# Altium schematic sheet Sheet_1_2024-11-17 (1).schdoc
size 361 x 224 mm
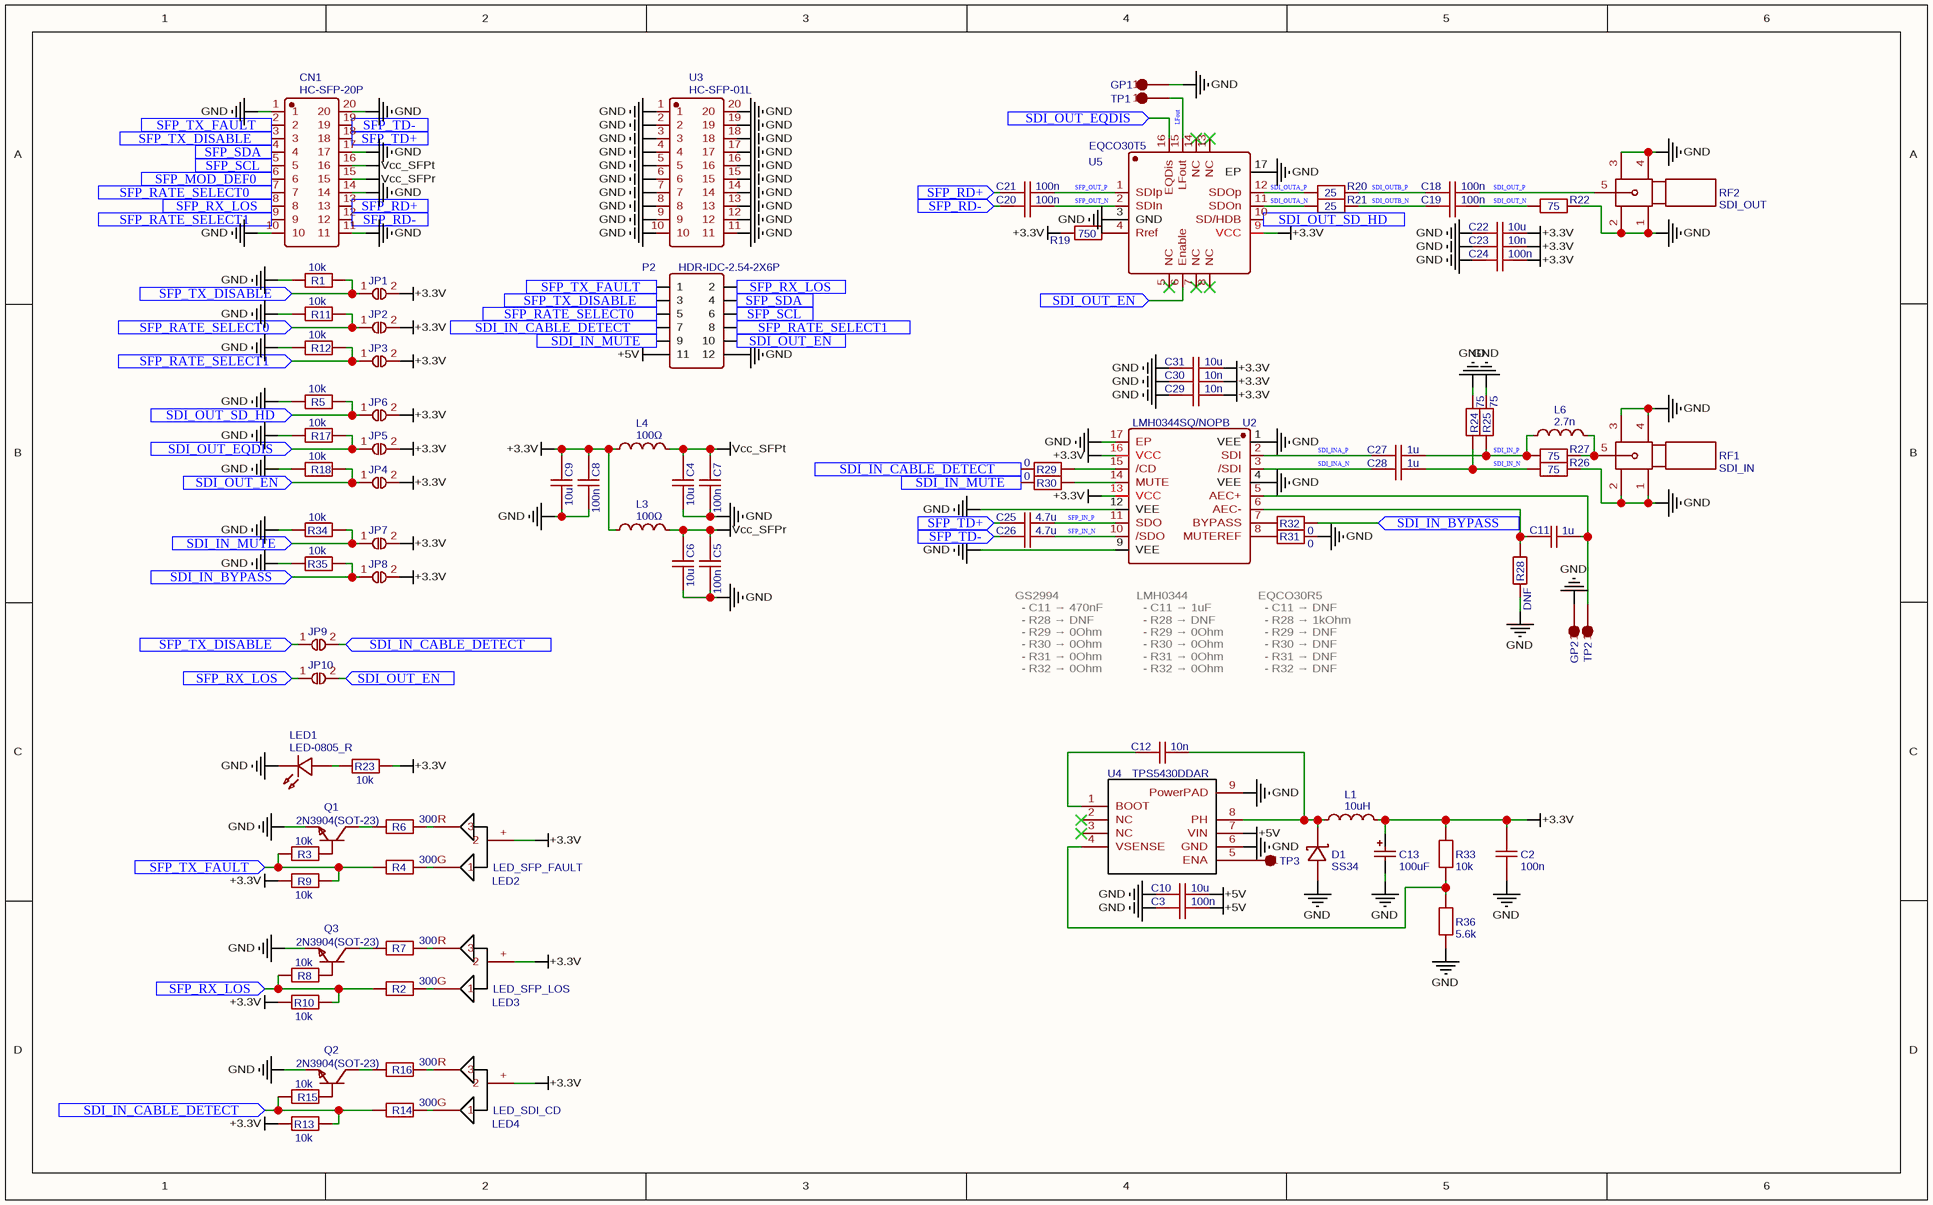
[diagram p0: Sheet_1_2024-11-17 (1).schdoc]

## Parts
C2  100n  [C0603]
C3  100n  [C0603]
C4  10u  [C0603]
C5  100n  [C0603]
C6  10u  [C0603]
C7  100n  [C0603]
C8  100n  [C0603]
C9  10u  [C0603]
C10  10u  [C0603]
C11  1u  [C0603]
C12  10n  [C0603]
C13  100uF  [CASE-B_3528]
C18  100n  [C0603]
C19  100n  [C0603]
C20  100n  [C0603]
C21  100n  [C0603]
C22  10u  [C0603]
C23  10n  [C0603]
C24  100n  [C0603]
C25  4.7u  [C0603]
C26  4.7u  [C0603]
C27  1u  [C0603]
C28  1u  [C0603]
C29  10n  [C0603]
C30  10n  [C0603]
C31  10u  [C0603]
CN1  HC-SFP-20P  [CONN-SMD_20P-P0.80_HCTL_HC-SFP-20P]
D1  SS34  [SMA_L4.3-W2.6-LS5.2-RD]
GP1  TEST-POINT-PTH-1X1  [TESTPOINT-SMD_L1.6-W0.8_RCU-0C]  (value not drawn)
GP2  TEST-POINT-PTH-1X1  [TESTPOINT-SMD_L1.6-W0.8_RCU-0C]  (value not drawn)
JP1  SOLDER BRIDGE  [SOLDER BRIDGE 2P BRIDGED]  (value not drawn)
JP2  SOLDER BRIDGE  [SOLDER BRIDGE 2P BRIDGED]  (value not drawn)
JP3  SOLDER BRIDGE  [SOLDER BRIDGE 2P BRIDGED]  (value not drawn)
JP4  SOLDER BRIDGE  [SOLDER BRIDGE 2P BRIDGED]  (value not drawn)
JP5  SOLDER BRIDGE  [SOLDER BRIDGE 2P BRIDGED]  (value not drawn)
JP6  SOLDER BRIDGE  [SOLDER BRIDGE 2P BRIDGED]  (value not drawn)
JP7  SOLDER BRIDGE  [SOLDER BRIDGE 2P BRIDGED]  (value not drawn)
JP8  SOLDER BRIDGE  [SOLDER BRIDGE 2P BRIDGED]  (value not drawn)
JP9  SOLDER BRIDGE  [SOLDER BRIDGE 2P BRIDGED]  (value not drawn)
JP10  SOLDER BRIDGE  [SOLDER BRIDGE 2P BRIDGED]  (value not drawn)
L1  10uH  [IND-SMD_L4.0-W4.0]
L3  100Ω  [L0805]
L4  100Ω  [L0805]
L6  2.7n  [L0603]
LED1  LED-0805_R  [LED0805_RED]
LED2  LED_SFP_FAULT  [LED RED/GREEN]
LED3  LED_SFP_LOS  [LED RED/GREEN]
LED4  LED_SDI_CD  [LED RED/GREEN]
P2  HDR-IDC-2.54-2X6P  [IDC-TH_12P-P2.54_BOOMELE-2X6P-2.54MM]
Q1  2N3904(SOT-23)  [SOT-23-3_L2.9-W1.3-P1.90-LS2.4-TR]
Q2  2N3904(SOT-23)  [SOT-23-3_L2.9-W1.3-P1.90-LS2.4-TR]
Q3  2N3904(SOT-23)  [SOT-23-3_L2.9-W1.3-P1.90-LS2.4-TR]
R1  10k  [R0603]
R2  300  [R0603]
R3  10k  [R0603]
R4  300  [R0603]
R5  10k  [R0603]
R6  300  [R0603]
R7  300  [R0603]
R8  10k  [R0603]
R9  10k  [R0603]
R10  10k  [R0603]
R11  10k  [R0603]
R12  10k  [R0603]
R13  10k  [R0603]
R14  300  [R0603]
R15  10k  [R0603]
R16  300  [R0603]
R17  10k  [R0603]
R18  10k  [R0603]
R19  750  [R0603]
R20  25  [R0603]
R21  25  [R0603]
R22  75  [R0603]
R23  10k  [R0603]
R24  75  [R0603]
R25  75  [R0603]
R26  75  [R0603]
R27  75  [R0603]
R28  DNF  [R0603]
R29  0  [R0402]
R30  0  [R0402]
R31  0  [R0402]
R32  0  [R0402]
R33  10k  [R0603]
R34  10k  [R0603]
R35  10k  [R0603]
R36  5.6k  [R0603]
RF1  SDI_IN  [SMA-SMD_BWSMA-KE-P001]
RF2  SDI_OUT  [SMA-SMD_BWSMA-KE-P001]
TP1  TEST-POINT-PTH-1X1  [TESTPOINT-SMD_L1.6-W0.8_RCU-0C]  (value not drawn)
TP2  TEST-POINT-PTH-1X1  [TESTPOINT-SMD_L1.6-W0.8_RCU-0C]  (value not drawn)
TP3  TEST-POINT-PTH-1X1  [TESTPOINT-SMD_L1.6-W0.8_RCU-0C]  (value not drawn)
U2  LMH0344SQ/NOPB  [QFN-16_L4.0-W4.0-P0.65-BL-EP2.6]
U3  HC-SFP-01L  [TH_HC-SFP-01L]
U4  TPS5430DDAR  [ESOP-8_L4.9-W3.9-P1.27-LS6.0-TL-EP]
U5  EQCO30T5  [QFN16G-0.65-4X4MM]

## Ports
SDI_IN_BYPASS (in), SDI_IN_CABLE_DETECT (in), SDI_IN_MUTE (in), SDI_OUT_EN (in), SDI_OUT_EQDIS (in), SDI_OUT_SD_HD (in), SFP_MOD_DEF0 (in), SFP_RATE_SELECT0 (in), SFP_RATE_SELECT1 (in), SFP_RD+ (in), SFP_RD- (in), SFP_RX_LOS (in), SFP_SCL (in), SFP_SDA (in), SFP_TD+ (in), SFP_TD- (in), SFP_TX_DISABLE (in), SFP_TX_FAULT (in)

## Nets
+3.3V: C2.2 C8.2 C9.2 C13.1 C22.2 C23.2 C24.2 C29.2 C30.2 C31.2 JP1.2(B) JP2.2(B) JP3.2(B) JP4.2(B) JP5.2(B) JP6.2(B) JP7.2(B) JP8.2(B) L1.2 L3.1 L4.1 LED2.+(2) LED3.+(2) LED4.+(2) R9.2 R10.2 R13.2 R19.1 R23.1 R33.1 U2.13(VCC) U2.16(VCC) U5.9(VCC)
+5V: C3.2 C10.2 P2.11 U4.7(VIN)
GND: C2.1 C3.1 C4.1 C5.1 C6.1 C7.1 C8.1 C9.1 C10.1 C13.2 C22.1 C23.1 C24.1 C29.1 C30.1 C31.1 CN1.1 CN1.10 CN1.11 CN1.14 CN1.17 CN1.20 D1.2(A) GP1.1 GP2.1 LED1.2 P2.12 Q1.1(E) Q2.1(E) Q3.1(E) R1.2 R5.2 R11.2 R12.2 R17.2 R18.2 R22.2 R24.1 R25.1 R26.2 R28.1 R31.1 R34.2 R35.2 R36.2 RF1.1 RF1.2 RF1.3 RF1.4 RF2.1 RF2.2 RF2.3 RF2.4 U2.1(VEE) U2.4(VEE) U2.9(VEE) U2.12(VEE) U2.17(EP) U3.1 U3.2 U3.3 U3.4 U3.5 U3.6 U3.7 U3.8 U3.9 U3.10 U3.11 U3.12 U3.13 U3.14 U3.15 U3.16 U3.17 U3.18 U3.19 U3.20 U4.6(GND) U4.9(PowerPAD) U5.3(GND) U5.17(EP)
Vcc_SFPr: C5.2 C6.2 CN1.15 L3.2
Vcc_SFPt: C4.2 C7.2 CN1.16 L4.2
LFout: TP1.1 U5.15(LFout)
SDI_IN_BYPASS: JP8.1(A) R32.2 R35.1 ; port SDI_IN_BYPASS
SDI_IN_CABLE_DETECT: JP9.2(B) P2.7 R13.1 R14.2 R15.2 R29.1 ; port SDI_IN_CABLE_DETECT
SDI_IN_MUTE: JP7.1(A) P2.9 R30.1 R34.1 ; port SDI_IN_MUTE
SDI_IN_N: C28.2 R24.2 R26.1
SDI_IN_P: C27.2 L6.1 R25.2 R27.1
SDI_INA_N: C28.1 U2.3(/SDI)
SDI_INA_P: C27.1 U2.2(SDI)
SDI_OUT_EN: JP4.1(A) JP10.2(B) P2.10 R18.1 U5.6(Enable) ; port SDI_OUT_EN
SDI_OUT_EQDIS: JP5.1(A) R17.1 U5.16(EQDis) ; port SDI_OUT_EQDIS
SDI_OUT_N: C19.2 R22.1
SDI_OUT_P: C18.2 RF2.5
SDI_OUT_SD_HD: JP6.1(A) R5.1 U5.10(SD/HDB) ; port SDI_OUT_SD_HD
SDI_OUTA_N: R21.1 U5.11(SDOn)
SDI_OUTA_P: R20.1 U5.12(SDOp)
SDI_OUTB_N: C19.1 R21.2
SDI_OUTB_P: C18.1 R20.2
SFP_IN_N: C26.2 U2.10(/SDO)
SFP_IN_P: C25.2 U2.11(SDO)
SFP_MOD_DEF0: CN1.6 ; port SFP_MOD_DEF0
SFP_OUT_N: C20.2 U5.2(SDIn)
SFP_OUT_P: C21.2 U5.1(SDIp)
SFP_RATE_SELECT0: CN1.7 JP2.1(A) P2.5 R11.1 ; port SFP_RATE_SELECT0
SFP_RATE_SELECT1: CN1.9 JP3.1(A) P2.8 R12.1 ; port SFP_RATE_SELECT1
SFP_RD+: C21.1 CN1.13 ; port SFP_RD+
SFP_RD-: C20.1 CN1.12 ; port SFP_RD-
SFP_RX_LOS: CN1.8 JP10.1(A) P2.2 R2.2 R8.2 R10.1 ; port SFP_RX_LOS
SFP_SCL: CN1.5 P2.6 ; port SFP_SCL
SFP_SDA: CN1.4 P2.4 ; port SFP_SDA
SFP_TD+: C25.1 CN1.18 ; port SFP_TD+
SFP_TD-: C26.1 CN1.19 ; port SFP_TD-
SFP_TX_DISABLE: CN1.3 JP1.1(A) JP9.1(A) P2.3 R1.1 ; port SFP_TX_DISABLE
SFP_TX_FAULT: CN1.2 P2.1 R3.2 R4.2 R9.1 ; port SFP_TX_FAULT
NetC11_1: C11.1 R28.2 U2.6(AEC-)
NetC11_2: C11.2 TP2.1 U2.5(AEC+)
NetC12_1: C12.1 U4.1(BOOT)
NetC12_2: C12.2 D1.1(K) L1.1 U4.8(PH)
NetL6_2: L6.2 R27.2 RF1.5
NetLED1_1: LED1.1 R23.2
NetLED2_G: LED2.G(1) R4.1
NetLED2_R: LED2.R(3) R6.1
NetLED3_G: LED3.G(1) R2.1
NetLED3_R: LED3.R(3) R7.1
NetLED4_G: LED4.G(1) R14.1
NetLED4_R: LED4.R(3) R16.1
NetQ1_2: Q1.2(B) R3.1
NetQ1_3: Q1.3(C) R6.2
NetQ2_2: Q2.2(B) R15.1
NetQ2_3: Q2.3(C) R16.2
NetQ3_2: Q3.2(B) R8.1
NetQ3_3: Q3.3(C) R7.2
NetR19_2: R19.2 U5.4(Rref)
NetR29_2: R29.2 U2.15(/CD)
NetR30_2: R30.2 U2.14(MUTE)
NetR31_2: R31.2 U2.8(MUTEREF)
NetR32_1: R32.1 U2.7(BYPASS)
NetR33_2: R33.2 R36.1 U4.4(VSENSE)
NetTP3_1: TP3.1 U4.5(ENA)

Not connected (* = marked no-connect by the designer): U4 2(NC)* 3(NC)*; U5 5(NC)* 7(NC)* 8(NC)* 13(NC)* 14(NC)*

## Notes on the sheet
- GS2994
  - C11 → 470nF
  - R28 → DNF
  - R29 → 0Ohm
  - R30 → 0Ohm
  - R31 → 0Ohm
  - R32 → 0Ohm
- LMH0344
  - C11 → 1uF
  - R28 → DNF
  - R29 → 0Ohm
  - R30 → 0Ohm
  - R31 → 0Ohm
  - R32 → 0Ohm
- EQCO30R5
  - C11 → DNF
  - R28 → 1kOhm
  - R29 → DNF
  - R30 → DNF
  - R31 → DNF
  - R32 → DNF

## Library data of the parts
C2 C3 C5 C7 C8 C18-C21 C24 = 100n: nameAlias: Value(F); Contributor: LCEDA_Lib; spicePre: C; spiceSymbolName: C_0603_US
C4 C6 C9 C10 C22 C31 = 10u: nameAlias: Value(F); Contributor: LCEDA_Lib; spicePre: C; spiceSymbolName: C_0603_US
C11 C27 C28 = 1u: nameAlias: Value(F); Contributor: LCEDA_Lib; spicePre: C; spiceSymbolName: C_0603_US
C12 C23 C29 C30 = 10n: nameAlias: Value(F); Contributor: LCEDA_Lib; spicePre: C; spiceSymbolName: C_0603_US
C13 = 100uF: Manufacturer: Kyocera AVX; Manufacturer Part: TAJB107K006RNJ; nameAlias: Value; Supplier: LCSC; Supplier Part: C16133; JLCPCB Part Class: Basic Part; spicePre: C; spiceSymbolName: TAJB107K006RNJ
C25 C26 = 4.7u: nameAlias: Value(F); Contributor: LCEDA_Lib; spicePre: C; spiceSymbolName: C_0603_US
CN1 = HC-SFP-20P: Manufacturer: HCTL(华灿天禄); Contributor: LCSC; Supplier: LCSC; Supplier Part: C2897291; Manufacturer Part: HC-SFP-20P; JLCPCB Part Class: Extended Part; spicePre: C; spiceSymbolName: HC-SFP-20P
D1 = SS34: Manufacturer: MDD(辰达半导体); Supplier: LCSC; Manufacturer Part: SS34; Supplier Part: C8678; spicePre: D; spiceSymbolName: SS34_C8678
JP1-JP10 = SOLDER BRIDGE: Contributor: Luka Hierl; spicePre: J; spiceSymbolName: SOLDER BRIDGE
L1 = 10uH: Manufacturer: Sunlord(顺络); Manufacturer Part: SWPA4030S100MT; nameAlias: Value; Supplier: LCSC; Supplier Part: C38117; JLCPCB Part Class: Extended Part; spicePre: L; spiceSymbolName: SWPA4030S100MT
L3 L4 = 100Ω: Manufacturer: Sunlord(顺络); Manufacturer Part: GZ2012D101TF; nameAlias: Value; Supplier: LCSC; Supplier Part: C1015; JLCPCB Part Class: Basic Part; spicePre: L; spiceSymbolName: GZ2012D101TF
L6 = 2.7n: nameAlias: Value(H); Contributor: LCEDA_Lib; spicePre: L; spiceSymbolName: L0603_US
LED1 = LED-0805_R: Manufacturer: EVERLIGHT(台湾亿光); Manufacturer Part: 17-21SURC/S530-A3/TR8; Contributor: LCEDA_Lib; Supplier Part: C72037; spicePre: L; spiceSymbolName: LED-0805_R
LED2 = LED_SFP_FAULT: Contributor: Longhorn450; spicePre: L; spiceSymbolName: LED RED/GREEN CA
LED3 = LED_SFP_LOS: Contributor: Longhorn450; spicePre: L; spiceSymbolName: LED RED/GREEN CA
LED4 = LED_SDI_CD: Contributor: Longhorn450; spicePre: L; spiceSymbolName: LED RED/GREEN CA
P2 = HDR-IDC-2.54-2X6P: Manufacturer: BOOMELE; Manufacturer Part: IDC Box 2X6 2.54MM; Supplier: LCSC; Supplier Part: C9136; spicePre: P; spiceSymbolName: HDR-IDC-2.54-2X6P
Q1-Q3 = 2N3904(SOT-23): Manufacturer: KEC; Manufacturer Part: 2n3904S-RTK/PS; Contributor: LCEDA_Lib; Supplier: LCSC; Supplier Part: C18536; Paste Type: SOT-23; spicePre: Q; spiceSymbolName: 2N3904(SOT-23)
R1 R3 R5 R8-R13 R15 R17 R18 R23 R33-R35 = 10k: nameAlias: Value(Ω); Contributor: LCEDA_Lib; spicePre: R; spiceSymbolName: R_0603_EU
R2 R4 R6 R7 R14 R16 = 300: nameAlias: Value(Ω); Contributor: LCEDA_Lib; spicePre: R; spiceSymbolName: R_0603_EU
R19 = 750: nameAlias: Value(Ω); Contributor: LCEDA_Lib; spicePre: R; spiceSymbolName: R_0603_EU
R20 R21 = 25: nameAlias: Value(Ω); Contributor: LCEDA_Lib; spicePre: R; spiceSymbolName: R_0603_EU
R22 R24-R27 = 75: nameAlias: Value(Ω); Contributor: LCEDA_Lib; spicePre: R; spiceSymbolName: R_0603_EU
R28 = DNF: nameAlias: Value(Ω); Contributor: LCEDA_Lib; spicePre: R; spiceSymbolName: R_0603_EU
R29-R32 = 0: nameAlias: Value(Ω); Contributor: LCEDA_Lib; spicePre: R
  R29 R30 R32: spiceSymbolName: R_0402_EU
  R31: spiceSymbolName: R_0603_EU
R36 = 5.6k: nameAlias: Value(Ω); Contributor: LCEDA_Lib; spicePre: R; spiceSymbolName: R_0603_EU
RF1 = SDI_IN: Manufacturer: BAT WIRELESS; Manufacturer Part: BWSMA-KE-P001; Contributor: ytahn23; Supplier: LCSC; Supplier Part: C496550; spicePre: R; spiceSymbolName: BWSMA-KE-P001
RF2 = SDI_OUT: Manufacturer: BAT WIRELESS; Manufacturer Part: BWSMA-KE-P001; Contributor: ytahn23; Supplier: LCSC; Supplier Part: C496550; spicePre: R; spiceSymbolName: BWSMA-KE-P001
U2 = LMH0344SQ/NOPB: Manufacturer: TI(德州仪器); Contributor: LCSC; Supplier: LCSC; Supplier Part: C191792; Manufacturer Part: LMH0344SQ/NOPB; JLCPCB Part Class: Extended Part; spicePre: U; spiceSymbolName: LMH0344SQ/NOPB
U3 = HC-SFP-01L: Manufacturer: HCTL(华灿天禄); Contributor: LCSC; Supplier: LCSC; Supplier Part: C2897292; Manufacturer Part: HC-SFP-01L; JLCPCB Part Class: Extended Part; spicePre: U; spiceSymbolName: HC-SFP-01L
U4 = TPS5430DDAR: Manufacturer: TI(德州仪器); Supplier: LCSC; Manufacturer Part: TPS5430DDAR; Supplier Part: C9864; JLCPCB Part Class: Basic Part; spicePre: U; spiceSymbolName: TPS5430DDAR
U5 = EQCO30T5: Manufacturer: Microchip; Contributor: turtleforgaming; Manufacturer Part: EQCO30T5; link: https://www.microchip.com/en-us/product/eqco30r5; spicePre: U; spiceSymbolName: EQCO30T5
GP1 GP2 TP1-TP3 = TEST-POINT-PTH-1X1: spicePre: T; spiceSymbolName: TEST-POINT-PTH-1X1